# Altium project LaptopPower_RevA.PrjPcb
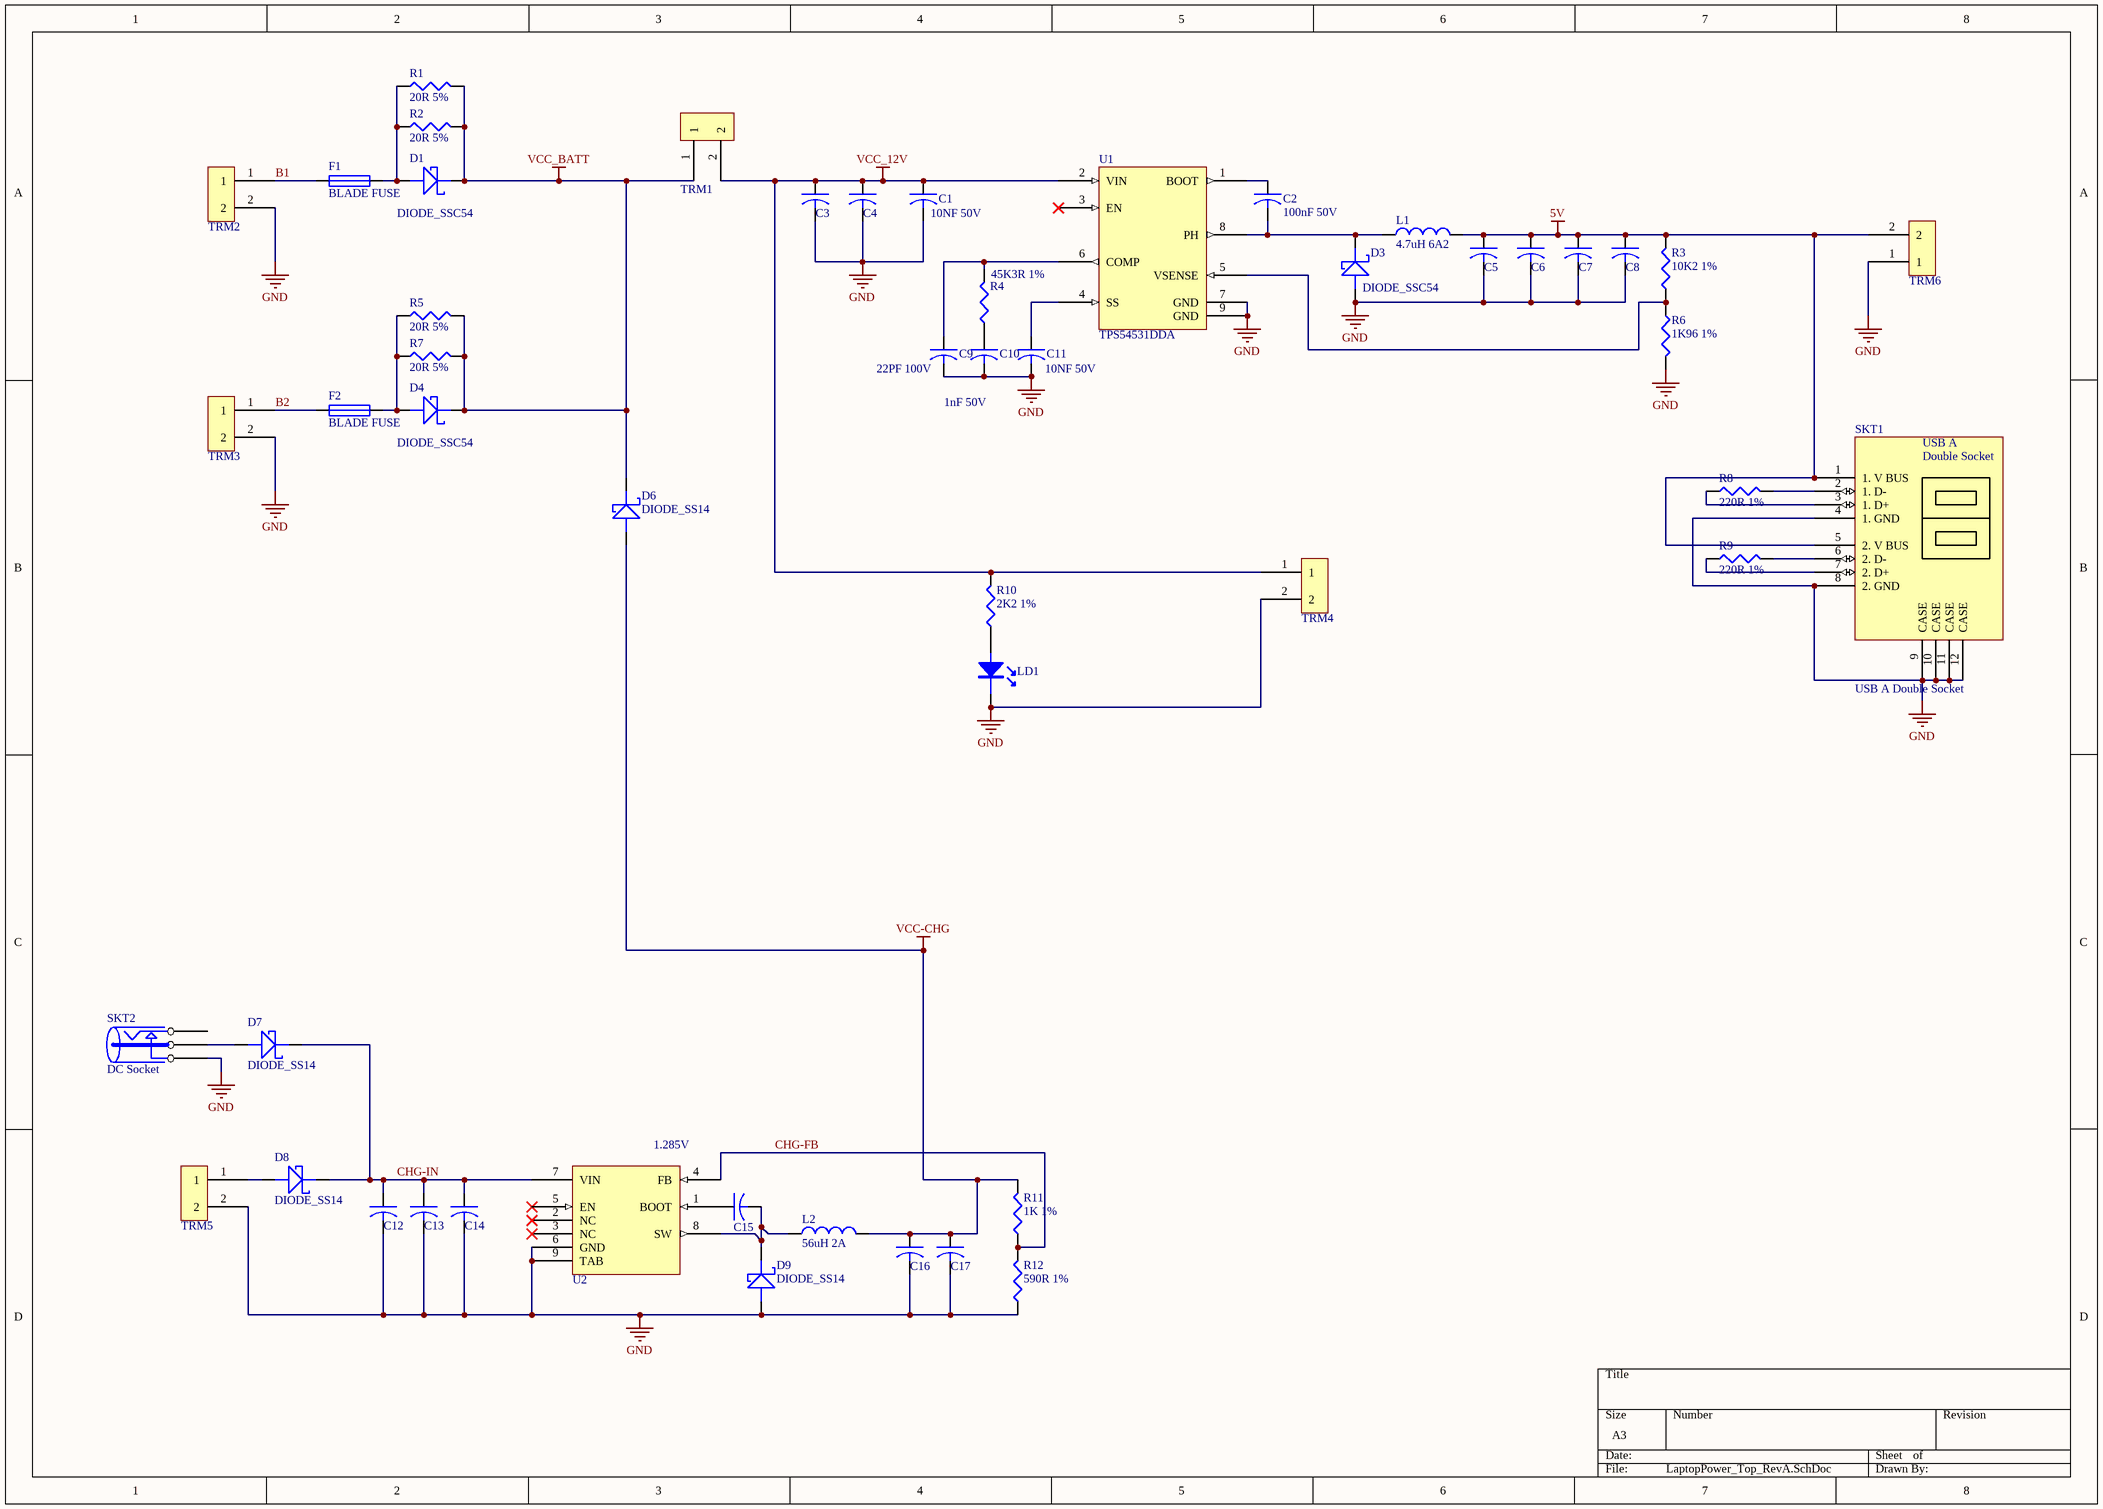
[diagram p0: LaptopPower_Top_RevA.SchDoc]
1 sheet, 51 parts. Net scope: global (net labels, ports and power ports of the same name join across sheets).
Board file: LaptopPower_RevA.PcbDoc

## Sheet LaptopPower_Top_RevA.SchDoc
size A3

### Parts
C1  10NF 50V  [0603]
C2  100nF 50V  [0603]
C3  10UF 25V  [1206]  (value not drawn)
C4  10UF 25V  [1206]  (value not drawn)
C5  10UF 25V  [1206]  (value not drawn)
C6  10UF 25V  [1206]  (value not drawn)
C7  10UF 25V  [1206]  (value not drawn)
C8  10UF 25V  [1206]  (value not drawn)
C9  22PF 100V  [0603]
C10  1nF 50V  [0603]
C11  10NF 50V  [0603]
C12  10UF 25V  [1206]  (value not drawn)
C13  10UF 25V  [1206]  (value not drawn)
C14  100nF 50V  [0603]  (value not drawn)
C15  10NF 50V  [0603]  (value not drawn)
C16  10UF 25V  [1206]  (value not drawn)
C17  10UF 25V  [1206]  (value not drawn)
D1  DIODE_SSC54  [DO-214AB]
D3  DIODE_SSC54  [DO-214AB]
D4  DIODE_SSC54  [DO-214AB]
D6  DIODE_SS14  [DO-214AC]
D7  DIODE_SS14  [DO-214AC]
D8  DIODE_SS14  [DO-214AC]
D9  DIODE_SS14  [DO-214AC]
F1  BLADE FUSE  [FUSEHOLDER_BLADE]
F2  BLADE FUSE  [FUSEHOLDER_BLADE]
L1  4.7uH 6A2  [Wurth744771156]
L2  56uH 2A  [Wurth744771156]
LD1  Green LED 0805  [0805DIODE]  (value not drawn)
R1  20R 5%  [2512]
R2  20R 5%  [2512]
R3  10K2 1%  [0603]
R4  45K3R 1%  [0603]
R5  20R 5%  [2512]
R6  1K96 1%  [0603]
R7  20R 5%  [2512]
R8  220R 1%  [0603]
R9  220R 1%  [0603]
R10  2K2 1%  [0603]
R11  1K 1%  [0603]
R12  590R 1%  [0603]
SKT1  USB A Double Socket  [USB_A_DoubleSocket]
SKT2  DC Socket  [SKT_PWR]
TRM1  Wurth 2way screw terminal  [TERM_2POS_HORIZ_5.08MM]  (value not drawn)
TRM2  Wurth 2way screw terminal  [TERM_2POS_HORIZ_5.08MM]  (value not drawn)
TRM3  Wurth 2way screw terminal  [TERM_2POS_HORIZ_5.08MM]  (value not drawn)
TRM4  Wurth 2way screw terminal  [TERM_2POS_HORIZ_5.08MM]  (value not drawn)
TRM5  Wurth 2way screw terminal  [TERM_2POS_HORIZ_5.08MM]  (value not drawn)
TRM6  Wurth 2way screw terminal  [TERM_2POS_HORIZ_5.08MM]  (value not drawn)
U1  TPS54531DDA  [PSOP-8]
U2  Buck Reg  [PSOP-8]  (value not drawn)

### Nets
5V: C5.1 C6.1 C7.1 C8.1 L1.2 R3.2 SKT1.1(1._V_BUS) SKT1.5(2._V_BUS) TRM6.2
GND: C1.2 C3.2 C4.2 C5.2 C6.2 C7.2 C8.2 C9.2 C10.2 C11.2 C12.2 C13.2 C14.2 C16.2 C17.2 D3.A D9.A LD1.K R6.2 R12.1 SKT1.4(1._GND) SKT1.8(2._GND) SKT1.9(CASE) SKT1.10(CASE) SKT1.11(CASE) SKT1.12(CASE) SKT2.SW TRM2.2 TRM3.2 TRM4.2 TRM5.2 TRM6.1 U1.7(GND) U1.9(GND) U2.6(GND) U2.9(TAB)
VCC-CHG: C16.1 C17.1 D6.A L2.2 R11.2
VCC_12V: C1.1 C3.1 C4.1 R10.2 TRM1.2 TRM4.1 U1.2(VIN)
VCC_BATT: D1.K D4.K D6.K R1.2 R2.2 R5.2 R7.2 TRM1.1
B1: F1.1 TRM2.1
B2: F2.1 TRM3.1
CHG-FB: R11.1 R12.2 U2.4(FB)
CHG-IN: C12.1 C13.1 C14.1 D7.K D8.K U2.7(VIN)
NetC2_1: C2.1 U1.1(BOOT)
NetC2_2: C2.2 D3.K L1.1 U1.8(PH)
NetC9_1: C9.1 R4.2 U1.6(COMP)
NetC10_1: C10.1 R4.1
NetC11_1: C11.1 U1.4(SS)
NetC15_1: C15.1 U2.1(BOOT)
NetC15_2: C15.2 D9.K L2.1 U2.8(SW)
NetD1_A: D1.A F1.2 R1.1 R2.1
NetD4_A: D4.A F2.2 R5.1 R7.1
NetD7_A: D7.A SKT2.PIN
NetD8_A: D8.A TRM5.1
NetLD1_A: LD1.A R10.1
NetR3_1: R3.1 R6.1 U1.5(VSENSE)
NetR8_1: R8.1 SKT1.3(1._D+)
NetR8_2: R8.2 SKT1.2(1._D-)
NetR9_1: R9.1 SKT1.7(2._D+)
NetR9_2: R9.2 SKT1.6(2._D-)

Not connected (* = marked no-connect by the designer): SKT2 COM; U1 3(EN)*; U2 2(NC)* 3(NC)* 5(EN)*

### Notes on the sheet
- (near U2) 1.285V
- (in symbol USB_A_Double) USB A; Double Socket

### Library data of the parts
C1 C11 C15 = CAP_10NF_50V_10%_0603: CAP CER 10NF 50V 10% X7R 0603; Manufacturer: Murata; Manufacturer P/N: GRM188R71H103KA01D
C2 C14 = CAP_100NF_50V_10%_0603: CAP CER 100nF 50V 10% X7R 0603; Manufacturer: Murata; Manufacturer P/N: GRM188R71H104KA93D
C3-C8 C12 C13 C16 C17 = CAP_10UF_25V_10%_1206: CAP CER 10UF 25V 10% X5R 1206; Manufacturer: Murata; Manufacturer P/N: GRM319R61E106KA12D
C9 = CAP_22PF_100V_5%_0603: CAP CER 22PF 100V 5% NP0 0603; Manufacturer: Murata; Manufacturer P/N: GRM1885C2A220JA01D
C10 = CAP_1NF_50V_10%_0603: CAP CER 1nF 50V 10% X7R 0603; Manufacturer: Murata; Manufacturer P/N: GRM188R71H102KA01D
D1 D3 D4 = DIODE_SSC54: Schottky Diode, 5A, 40V SSC54, DO214AB; Manufacturer: Vishay; Manufacturer P/N: SSC54-E3/9AT
D6-D9 = DIODE_SS14: Schottky Diode, 1A, 40V SS14; Manufacturer: Fairchild; Manufacturer P/N: SS14
F1 F2 = FUSE_BLADE_500V_30A_PCB: FUSE CLIP BLADE 500V 30A PCB; Manufacturer: Keystone Electronics; Manufacturer P/N: 3522-2
L1 = IND_4.7uH_6A2: FIXED IND 4.7UH 6.2A 34 MOHM; Manufacturer: Wurth Electronics Inc; Manufacturer P/N: 74437356047
L2 = IND_56uH_2.01A: FIXED IND 56UH 2.01A 110 MOHM; Manufacturer: Wurth Electronics Inc; Manufacturer P/N: 744771156
LD1 = LED_Green_0805: WL-SMCW SMD CHIP LED WATERCLEAR; Manufacturer: Wurth; Manufacturer P/N: 150080VS75000
R1 R2 R5 R7 = RES_20R_5%_2512: Resistor, 20R, 5%, 2512; Manufacturer: Stackpole Electronics Inc; Manufacturer P/N: RMCF2512JT20R0
R3 = RES_10K2_1%_0603: Resistor, 10K2, 1%, 0603; Manufacturer: Yageo; Manufacturer P/N: RC0603FR-0710K2L
R4 = RES_45K3_1%_0603: Resistor, 45K3, 1%, 0603; Manufacturer: Bourns Inc; Manufacturer P/N: CR0603-FX-4532ELF
R6 = RES_1K96_1%_0603: Resistor, 1K96, 1%, 0603; Manufacturer: Yageo; Manufacturer P/N: RC0603FR-071K96L
R8 R9 = RES_220R_1%_0603: Resistor, 220R, 1%, 0603; Manufacturer: Bourns Inc; Manufacturer P/N: CR0603-FX-2200ELF
R10 = RES_2K2_1%_0603: Resistor, 2K2, 1%, 0603; Manufacturer: Bourns Inc; Manufacturer P/N: CR0603-FX-2201ELF
R11 = RES_1K_1%_0603: Resistor, 1K, 1%, 0603; Manufacturer: Bourns Inc; Manufacturer P/N: CR0603-FX-1001ELF
R12 = RES_590R_1%_0603: Resistor, 590R, 1%, 0603; Manufacturer: Bourns Inc; Manufacturer P/N: CR0603-FX-5900ELF
SKT1 = USB_A_Double: PartNo: P1301; Supplier: Altronics
SKT2 = SOCKET_DC: Manufacturer: N/A; Manufacturer P/N: N/A
TRM1-TRM6 = TRM_2way_ScrewTerminal: TERM BLOCK 2POS HORIZ 5.08MM T/H; Manufacturer: Wurth Electronics Inc; Manufacturer P/N: 691216510002
U1 = IC_SMPS_TPS54531: SMPS; Manufacturer: TI; Manufacturer P/N: TPS54531DDA
U2 = IC_REG_LM22675: IC REG BUCK 5V 1A 8SOPWRPAD; Manufacturer: Texas Instruments; Manufacturer P/N: LM22675MRE-5.0/NOPB